# Altium schematic sheet LLCC68.SchDoc
size A3; DocumentNumber: 1; SheetNumber: 1; SheetTotal: 2
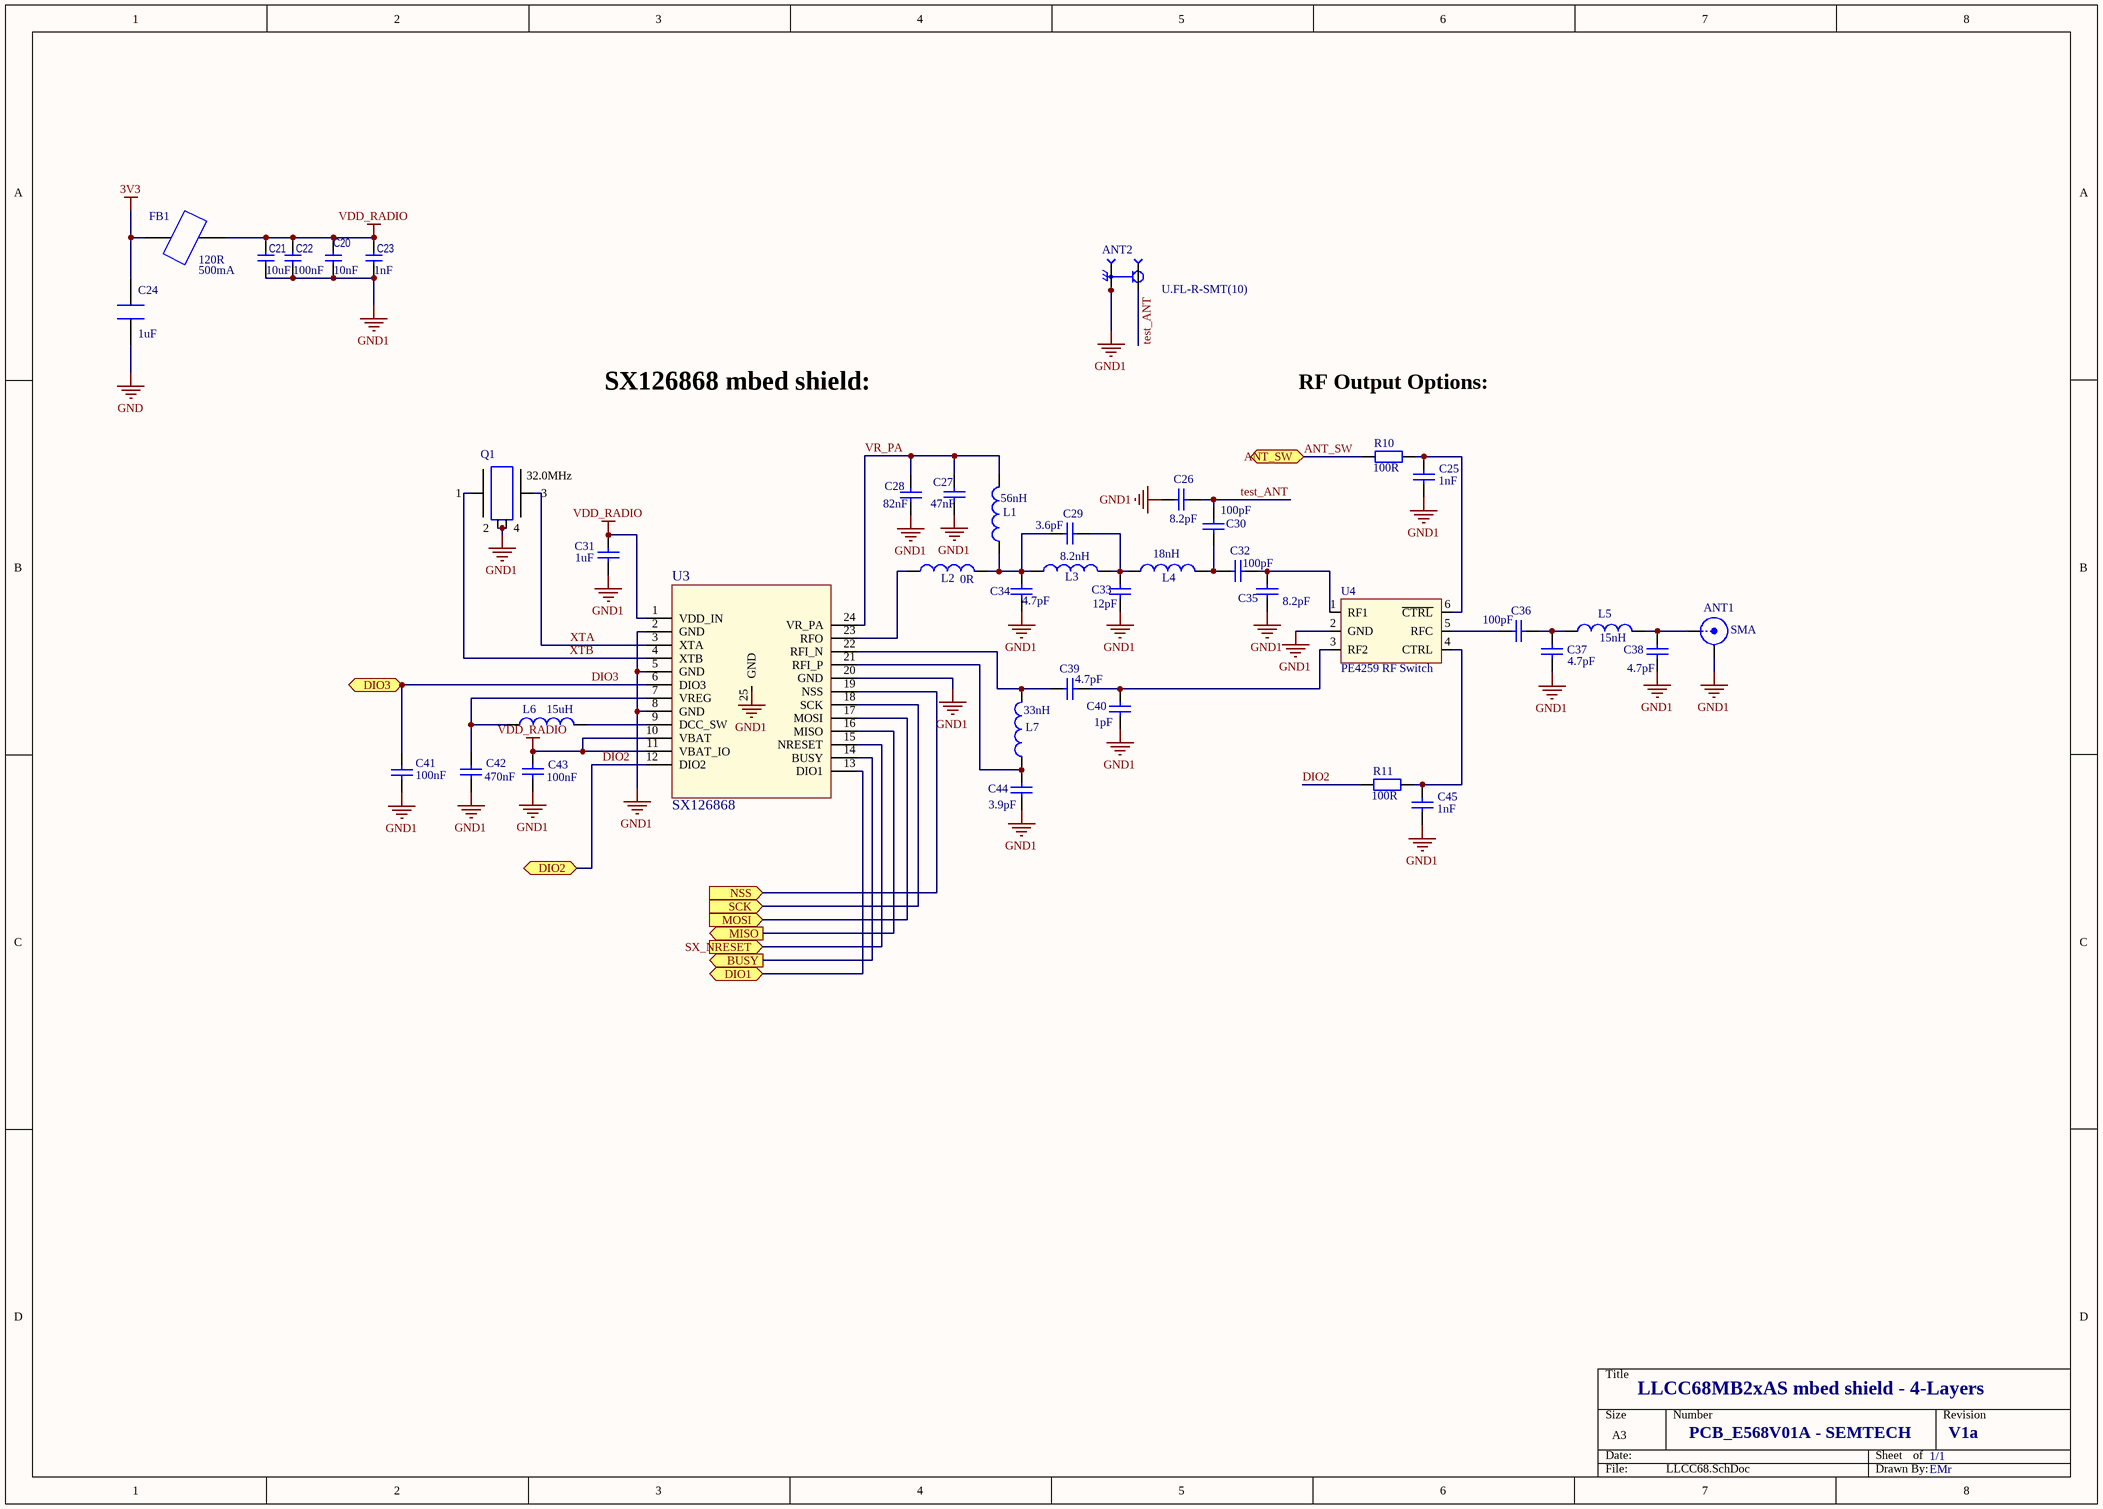
[diagram p0: LLCC68.SchDoc]

## Parts
ANT1  SMA  [SMA_end_launch_1.0mm_9.52mm]
ANT2  U.FL-R-SMT(10)  [HRS_U.FL-R-SMT(10)]
C20  10nF  [rlc_402_smd]
C21  10uF  [rlc_402_smd]
C22  100nF  [rlc_402_smd]
C23  1nF  [rlc_402_smd]
C24  1uF  [rlc_402_smd]
C25  1nF  [rlc_402_smd]
C26  8.2pF  [rlc_402_smd]
C27  47nF  [rlc_402_smd]
C28  82nF  [rlc_402_smd]
C29  3.6pF  [rlc_402_smd]
C30  100pF  [rlc_402_smd]
C31  1uF  [rlc_402_smd]
C32  100pF  [rlc_402_smd]
C33  12pF  [rlc_402_smd]
C34  4.7pF  [rlc_402_smd]
C35  8.2pF  [rlc_402_smd]
C36  100pF  [rlc_402_smd]
C37  4.7pF  [rlc_402_smd]
C38  4.7pF  [rlc_402_smd]
C39  4.7pF  [rlc_402_smd]
C40  1pF  [rlc_402_smd]
C41  100nF  [rlc_402_smd]
C42  470nF  [rlc_402_smd]
C43  100nF  [rlc_402_smd]
C44  3.9pF  [rlc_402_smd]
C45  1nF  [rlc_402_smd]
FB1  Rated Current: 500mA  [R0603]  (hidden comment: 120R)
L1  56nH  [rlc_402_smd]
L2  0R  [rlc_402_smd]
L3  8.2nH  [rlc_402_smd]
L4  18nH  [rlc_402_smd]
L5  15nH  [rlc_402_smd]
L6  15uH  [rlc_805_smd enlarged]
L7  33nH  [rlc_402_smd]
Q1  value 32.0MHz  [nd2016da]  (hidden comment: 32MHz)
R10  100R  [rlc_402_smd]
R11  100R  [rlc_402_smd]
U3  SX126868  [vqfn24_4x4mm]
U4  PE4259 RF Switch  [SC70-6]

## Ports
ANT_SW (bidir), BUSY (out), DIO1 (bidir), DIO2 (bidir), DIO3 (bidir), MISO (out), MOSI (in), NSS (in), SCK (in), SX_NRESET (in)

## Nets
3V3: C24.1(T1) FB1.1(P1)
GND: C24.2(T2)
GND1: ANT1.2(GND) ANT2.2(GND) ANT2.3(GND) C20.2 C21.2 C22.2 C23.2 C25.2 C26.1 C27.1 C28.1 C31.1 C33.1 C34.1 C35.1 C37.1 C38.1 C40.1 C41.1 C42.1 C43.1 C44.1 C45.2 Q1.2 Q1.4 U3.2(GND) U3.5(GND) U3.8(GND) U3.20(GND) U3.25(GND) U4.2(GND)
VDD_RADIO: C20.1 C21.1 C22.1 C23.1 C31.2 C43.2 FB1.2(P2) U3.1(VDD_IN) U3.10(VBAT) U3.11(VBAT_IO)
ANT_SW: R10.2 ; port ANT_SW
BUSY: U3.14(BUSY) ; port BUSY
DIO1: U3.13(DIO1) ; port DIO1
DIO2: R11.2 U3.12(DIO2) ; port DIO2
DIO3: C41.2 U3.6(DIO3) ; port DIO3
MISO: U3.16(MISO) ; port MISO
MOSI: U3.17(MOSI) ; port MOSI
NSS: U3.19(NSS) ; port NSS
SCK: U3.18(SCK) ; port SCK
SX_NRESET: U3.15(NRESET) ; port SX_NRESET
test_ANT: ANT2.1(SIG) C26.2 C30.1
VR_PA: C27.2 C28.2 L1.2 U3.24(VR_PA)
XTA: Q1.3 U3.3(XTA)
XTB: Q1.1 U3.4(XTB)
NetANT1_1: ANT1.1(Signal) C38.2 L5.2
NetC25_1: C25.1 R10.1 U4.6(~{CTRL})
NetC29_1: C29.1 C33.2 L3.2 L4.1
NetC29_2: C29.2 C34.2 L1.1 L2.2 L3.1
NetC30_2: C30.2 C32.2 L4.2
NetC32_1: C32.1 C35.2 U4.1(RF1)
NetC36_1: C36.1 C37.2 L5.1
NetC36_2: C36.2 U4.5(RFC)
NetC39_1: C39.1 C40.2 U4.3(RF2)
NetC39_2: C39.2 L7.2 U3.22(RFI_N)
NetC42_2: C42.2 L6.1 U3.7(VREG)
NetC44_2: C44.2 L7.1 U3.21(RFI_P)
NetC45_1: C45.1 R11.1 U4.4(CTRL)
NetL2_1: L2.1 U3.23(RFO)
NetL6_2: L6.2 U3.9(DCC_SW)

## Notes on the sheet
- SX126868 mbed shield:
- RF Output Options:
- LLCC68MB2xAS mbed shield - 4-Layers
- PCB_E568V01A - SEMTECH
- 1/1
- V1a
- EMr

## Library data of the parts
ANT1 = SMA: SMA Straight Connector; LatestRevisionDate: 05-oct-2007  -  Semtech; LatestRevisionNote: Re-released for DXP Platform.; Publisher: Altium Limited
ANT2 = U.FL-R-SMT(10): U.FL _UMCC_ Connector Receptacle, Male Pin 50Ohm Surface Mount Solder; MP: U.FL-R-SMT_10_; MF: Hirose; Availability: Unavailable; SnapEDA_Link: https://www.snapeda.com/parts/U.FL-R-SMT%2810%29/Hirose%20Electric%20Co%20Ltd/view-part/46852/?ref=snap; Value: *; Price: None; Package: FakePackage u
C20-C23 = ProE.tmp_22p_13
  C20: Value: 10nF
  C21: Value: 10uF
  C22: Value: 100nF
  C23: Value: 1nF
C24 = E-02-0021: MLCC 4.7uF 0805 X5R 10V; Manufacturer: Murata; Manufacturer Part Number: GRM219R61A475KE34; Part Creator: JG; LEVEL: STD; DEVICE: C; FORWARD_PCB: 1; Rated Voltage (V): 10; Approx Volume Cost ($): 0.048; Approved: NO; Value: 1uF; XMOS Part Number: E-02-0021; Dielectric: X5R; Tolerance (%): 10; Datasheet: http://search.murata.co.jp/Ceramy/image/img/PDF/ENG/GRM219R61A475KE34.pdf; Max Height (mm): 0.95; Digikey Link: http://search.digikey.com/scripts/DkSearch/dksus.dll?lang=en&site=US&keywords=GRM219R61A475KE34
C25-C45 = Cap: Capacitor SMD; Published: 8-Jun-2000; LatestRevisionDate: 05-oct-2007  -  Semtech; LatestRevisionNote: Re-released for DXP Platform.; Publisher: Altium Limited
  C25 C45: Value: 1nF
  C26 C35: Value: 8.2pF
  C27: Value: 47nF
  C28: Value: 82nF
  C29: Value: 3.6pF
  C30 C32 C36: Value: 100pF
  C31: Value: 1uF
  C33: Value: 12pF
  C34 C37-C39: Value: 4.7pF
  C40: Value: 1pF
  C41 C43: Value: 100nF
  C42: Value: 470nF
  C44: Value: 3.9pF
FB1 = E-08-0007: Ferrite Bead, 120R AT 100MHz, 0603, 500mA; Manufacturer: Murata; Manufacturer Part Number: BLM18AG121SN1; Part Creator: JG; LEVEL: STD; DEVICE: FB; FORWARD_PCB: 1; I_RATED: XXA; Max DC Resistance: 0.18R; Approx Volume Cost ($): 0.022; Approved: NO; Value: 120R; XMOS Part Number: E-08-0007; Datasheet: http://search.murata.co.jp/Ceramy/image/img/PDF/ENG/L0110S0100BLM18A.pdf; Max Height (mm): 0.95; Digikey Link: http://search.digikey.com/scripts/DkSearch/dksus.dll?lang=en&site=US&keywords=BLM18AG121SN1
L1-L7 = Inductor: Inductor SMD; Code_IEC: 1005; Published: 8-Jun-2000; LatestRevisionDate: 05-oct-2007  -  Semtech; LatestRevisionNote: Re-released for DXP Platform.; Publisher: Altium Limited; Code_JEITA: 0402
  L1: Value: 56nH
  L2: Value: 0R
  L3: Value: 8.2nH
  L4: Value: 18nH
  L5: Value: 15nH
  L6: Value: 15uH
  L7: Value: 33nH
Q1 = Xtal GND: Crystal with GND pins; LatestRevisionDate: 05-oct-2007  -  Semtech
R10 R11 = Resistor: Resistor SMD - IEC symbol version; LatestRevisionDate: 27-Jul-20  -  Semtech; Value: 100R
U3 = SX126x: SX1262- Ultra low power RF transceiver
U4 = PE4259 RF Switch: PE4259 Peregrine RF Switch; LatestRevisionDate: 03-Sep-2012 -  Semtech